# Altium schematic sheet Project_Arduino DUE shield.schdoc
size 437 x 296 mm
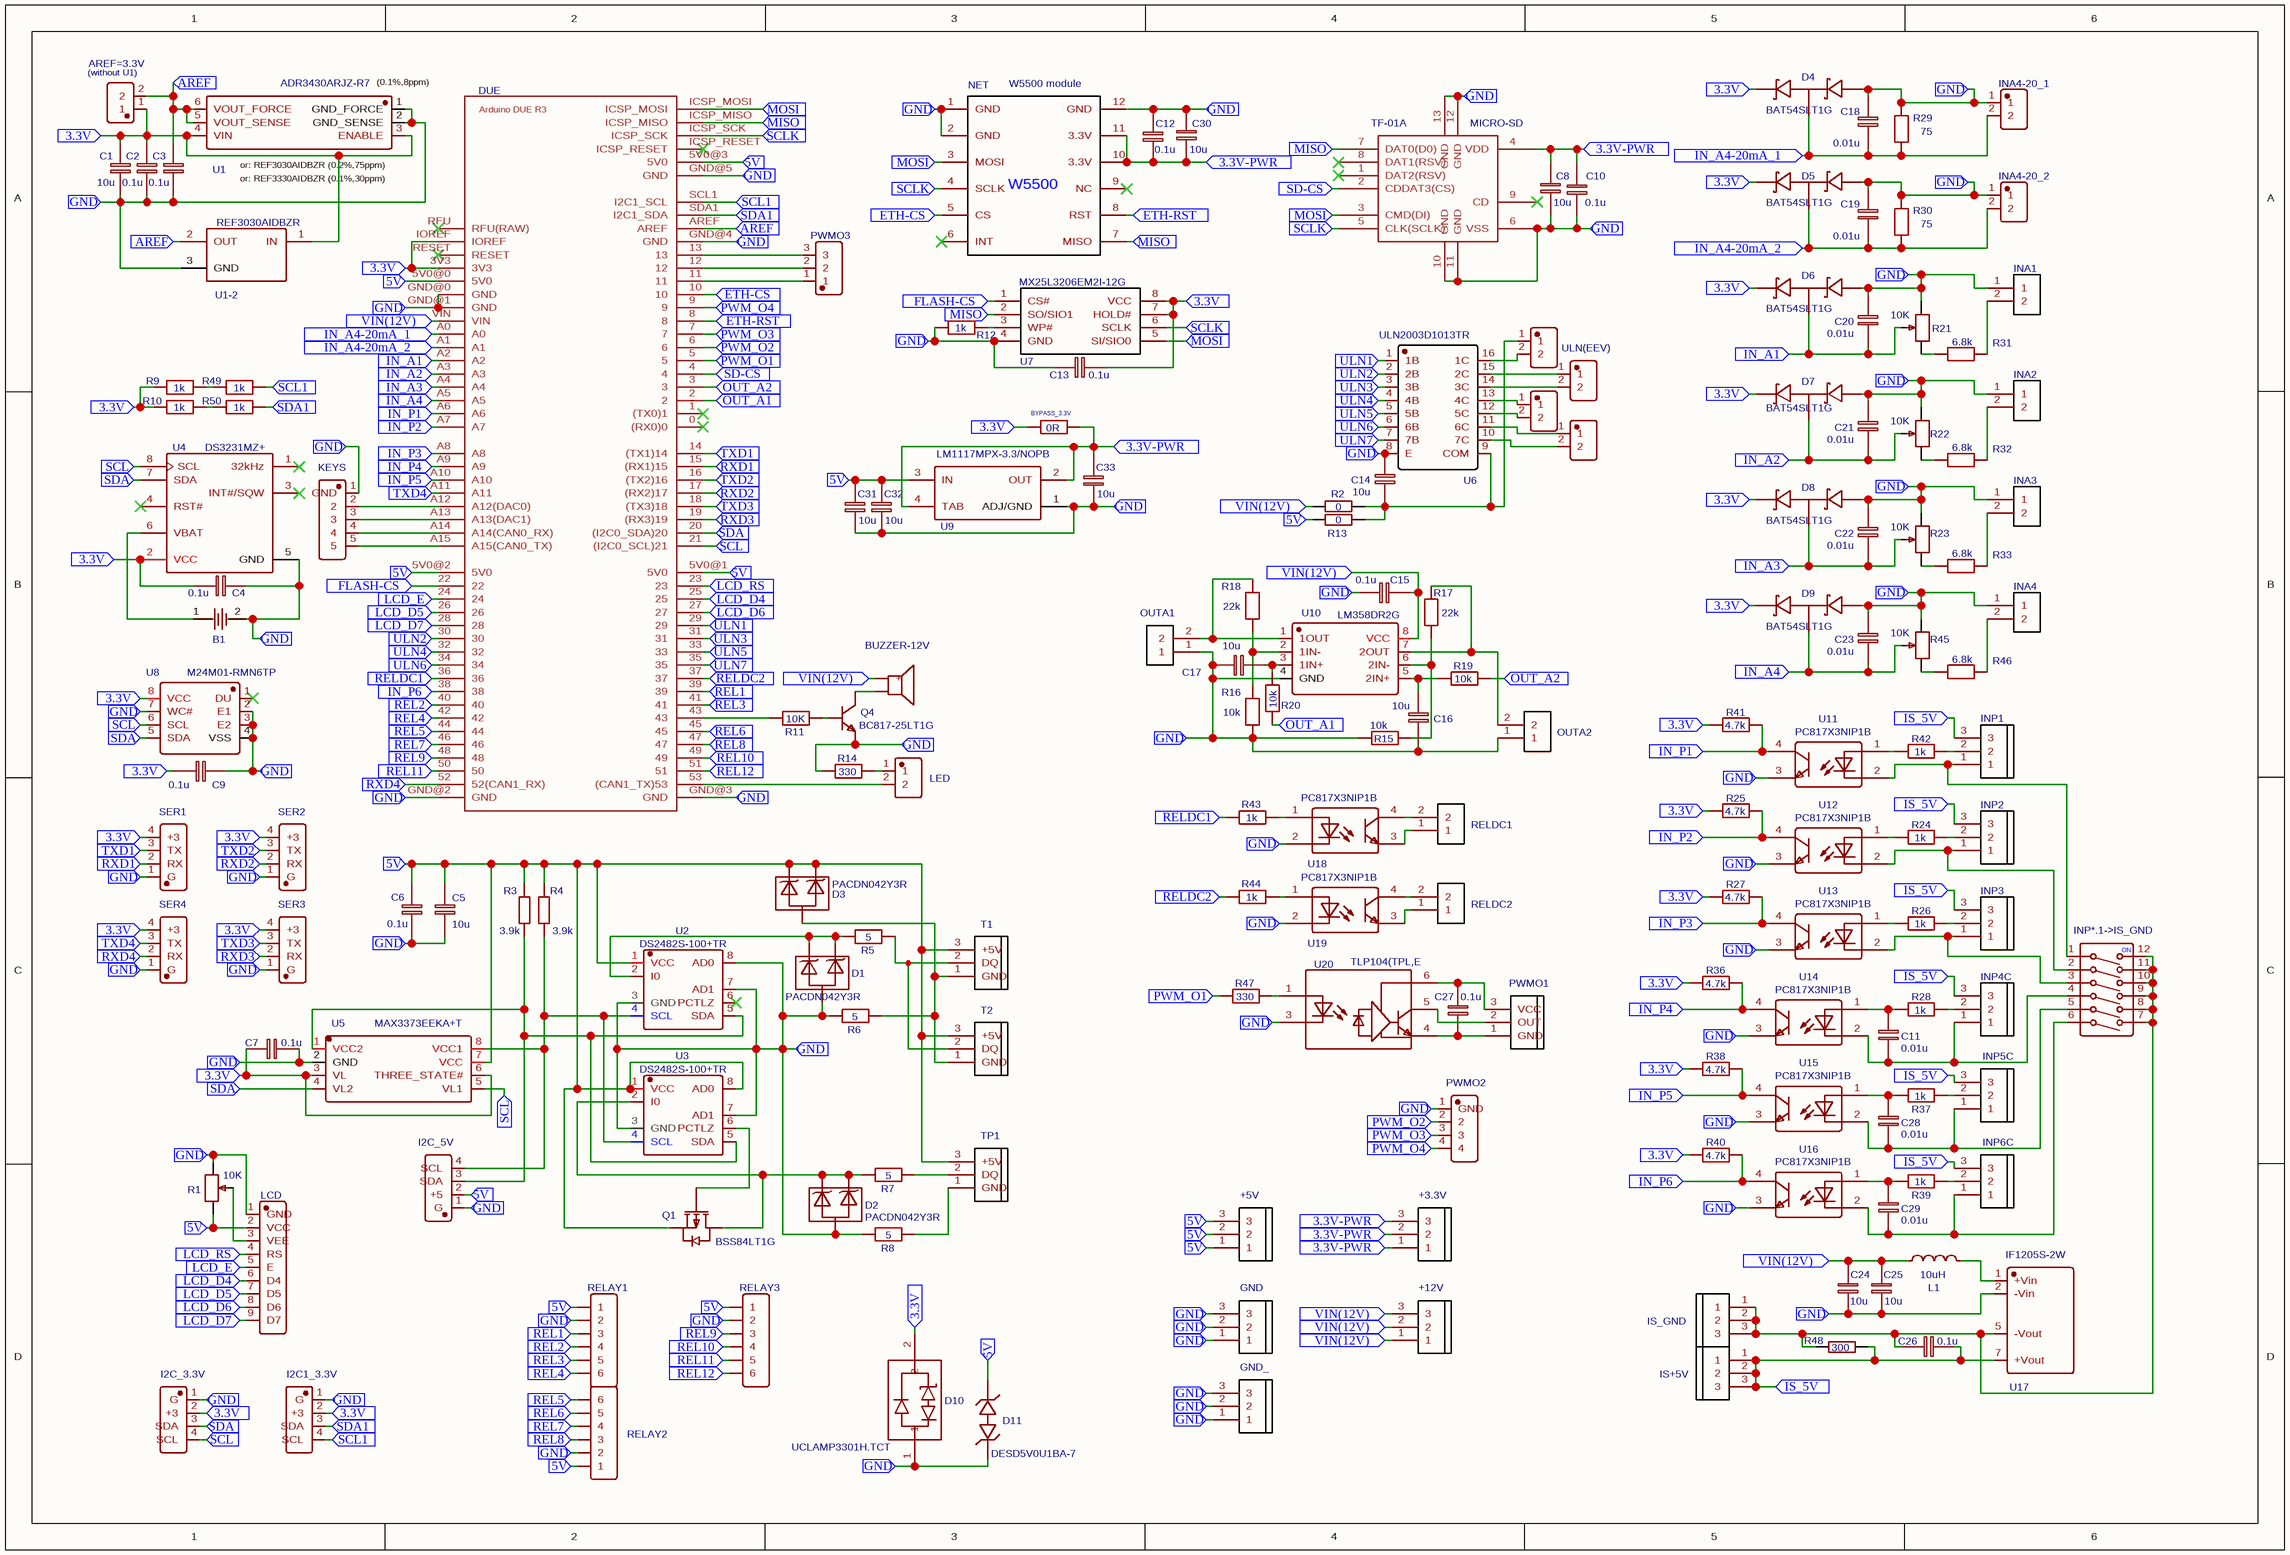
[diagram p0: Project_Arduino DUE shield.schdoc]

## Parts
+3.3V  KF128L-5.08-3P  [CONN-TH_3P-P5.08_KF128L-5.08-3P]  (value not drawn)
+5V  KF128L-5.08-3P  [CONN-TH_3P-P5.08_KF128L-5.08-3P]  (value not drawn)
+12V  KF128L-5.08-3P  [CONN-TH_3P-P5.08_KF128L-5.08-3P]  (value not drawn)
AREF=3.3V  A2541WV-2P  [HDR-TH_P2.54-H-M_A2541WV-2P]  (value not drawn)
B1  CR2032-BS-2-1  [BAT-TH_BS-2-1]  (value not drawn)
BUZZER-12V  TMB12A12  [BUZ-TH_BD12.0-P7.60-D0.6-FD]  (value not drawn)
BYPASS_3.3V  0R  [R0805]
C1  10u  [C_805]
C2  0.1u  [C0603]
C3  0.1u  [C0603]
C4  0.1u  [C0603]
C5  10u  [C_805]
C6  0.1u  [C0603]
C7  0.1u  [C0603]
C8  10u  [C_805]
C9  0.1u  [C0603]
C10  0.1u  [C0603]
C11  0.01u  [C0603]
C12  0.1u  [C0603]
C13  0.1u  [C0603]
C14  10u  [C_805]
C15  0.1u  [C0603]
C16  10u  [C_805]
C17  10u  [C_805]
C18  0.01u  [C0603]
C19  0.01u  [C0603]
C20  0.01u  [C0603]
C21  0.01u  [C0603]
C22  0.01u  [C0603]
C23  0.01u  [C0603]
C24  10u  [C_805]
C25  10u  [C_805]
C26  0.1u  [C0603]
C27  0.1u  [C0603]
C28  0.01u  [C0603]
C29  0.01u  [C0603]
C30  10u  [C_805]
C31  10u  [C_805]
C32  10u  [C_805]
C33  10u  [C_805]
D1  PACDN042Y3R  [SOT-23-3_L3.0-W1.7-P0.95-LS2.9-BR]
D2  PACDN042Y3R  [SOT-23-3_L3.0-W1.7-P0.95-LS2.9-BR]
D3  PACDN042Y3R  [SOT-23-3_L3.0-W1.7-P0.95-LS2.9-BR]
D4  BAT54SLT1G  [SOT-23_L2.9-W1.3-P1.90-LS2.4-BR]
D5  BAT54SLT1G  [SOT-23_L2.9-W1.3-P1.90-LS2.4-BR]
D6  BAT54SLT1G  [SOT-23_L2.9-W1.3-P1.90-LS2.4-BR]
D7  BAT54SLT1G  [SOT-23_L2.9-W1.3-P1.90-LS2.4-BR]
D8  BAT54SLT1G  [SOT-23_L2.9-W1.3-P1.90-LS2.4-BR]
D9  BAT54SLT1G  [SOT-23_L2.9-W1.3-P1.90-LS2.4-BR]
D10  UCLAMP3301H.TCT  [SOD123-SOD523]
D11  DESD5V0U1BA-7  [SOD123-SOD523]
DUE  PA_DUE_BRD  [PA_DUE 1 HOLE]  (value not drawn)
GND  KF128L-5.08-3P  [CONN-TH_3P-P5.08_KF128L-5.08-3P]  (value not drawn)
GND_  KF128L-5.08-3P  [CONN-TH_3P-P5.08_KF128L-5.08-3P]  (value not drawn)
I2C1_3.3V  A2541WV-4P  [HDR-TH_4P-P2.54-V I2C 3.3V]  (value not drawn)
I2C_3.3V  A2541WV-4P  [HDR-TH_4P-P2.54-V I2C 3.3V]  (value not drawn)
I2C_5V  A2541WV-4P  [HDR-TH_4P-P2.54-V I2C 5V]  (value not drawn)
INA1  KF128L-5.08-2P  [CONN-TH_P5.08_KF128L-5.08-2P SIGN]  (value not drawn)
INA2  KF128L-5.08-2P  [CONN-TH_P5.08_KF128L-5.08-2P SIGN]  (value not drawn)
INA3  KF128L-5.08-2P  [CONN-TH_P5.08_KF128L-5.08-2P SIGN]  (value not drawn)
INA4  KF128L-5.08-2P  [CONN-TH_P5.08_KF128L-5.08-2P SIGN]  (value not drawn)
INA4-20_1  KF128L-3.5-2P  [CONN-TH_P3.50_KF128L-3.5-2P SIGN]  (value not drawn)
INA4-20_2  KF128L-3.5-2P  [CONN-TH_P3.50_KF128L-3.5-2P SIGN]  (value not drawn)
INP1  KF128L-5.08-3P  [CONN-TH_3P-P5.08_KF128L-5.08-3P INP]  (value not drawn)
INP2  KF128L-5.08-3P  [CONN-TH_3P-P5.08_KF128L-5.08-3P INP]  (value not drawn)
INP3  KF128L-5.08-3P  [CONN-TH_3P-P5.08_KF128L-5.08-3P INP]  (value not drawn)
INP4C  KF128L-5.08-3P  [CONN-TH_3P-P5.08_KF128L-5.08-3P INP]  (value not drawn)
INP5C  KF128L-5.08-3P  [CONN-TH_3P-P5.08_KF128L-5.08-3P INP]  (value not drawn)
INP6C  KF128L-5.08-3P  [CONN-TH_3P-P5.08_KF128L-5.08-3P INP]  (value not drawn)
INP*.1->IS_GND  EM-06-Q  [SW-SMD_12P-L15.1-W6.0-P2.54-LS9.8]  (value not drawn)
IS+5V  KF128L-5.08-3P  [CONN-TH_3P-P5.08_KF128L-5.08-3P]  (value not drawn)
IS_GND  KF128L-5.08-3P  [CONN-TH_3P-P5.08_KF128L-5.08-3P]  (value not drawn)
KEYS  A2541WV-5P  [HDR-TH_5P-P2.54-V]  (value not drawn)
L1  10uH  [IND-SMD_3.0-4.0W]
LCD  PZ254V-11-09P  [HDR-TH_9P-P2.54-V-M LCD]  (value not drawn)
LED  A2541WV-2P  [HDR-TH_P2.54-H-M_A2541WV-2P]  (value not drawn)
MICRO-SD  TF-01A  [TF-SMD_TF-01A]
NET  W5500 module  [W5500_MODULE]
OUTA1  KF128L-5.08-2P  [CONN-TH_P5.08_KF128L-5.08-2P SIGN]  (value not drawn)
OUTA2  KF128L-5.08-2P  [CONN-TH_P5.08_KF128L-5.08-2P SIGN]  (value not drawn)
PWMO1  KF128L-5.08-3P  [CONN-TH_3P-P5.08_KF128L-5.08-3P]  (value not drawn)
PWMO2  A2541WV-4P  [HDR-TH_4P-P2.54-V]  (value not drawn)
PWMO3  A2541WV-3P  [HDR-TH_3P-P2.54-V-M]  (value not drawn)
Q1  BSS84LT1G  [SOT-23-3_L2.9-W1.6-P1.90-LS2.8-BR]
Q4  BC817-25LT1G  [SOT-23-3_L2.9-W1.6-P1.90-LS2.8-BR]
R1  10K  [RES-ADJ-SMD_3314J]
R2  0  [R1206]
R3  3.9k  [R0603]
R4  3.9k  [R0603]
R5  5  [R0603]
R6  5  [R0603]
R7  5  [R0603]
R8  5  [R0603]
R9  1k  [R0805]
R10  1k  [R0805]
R11  10K  [R0603]
R12  1k  [R0603]
R13  0  [R1206]
R14  330  [R0603]
R15  10k  [R0603]
R16  10k  [R0603]
R17  22k  [R0603]
R18  22k  [R0603]
R19  10k  [R0603]
R20  10k  [R0603]
R21  10K  [RES-ADJ-SMD_3314J]
R22  10K  [RES-ADJ-SMD_3314J]
R23  10K  [RES-ADJ-SMD_3314J]
R24  1k  [R0603]
R25  4.7k  [R0603]
R26  1k  [R0603]
R27  4.7k  [R0603]
R28  1k  [R0603]
R29  75  [R0805]
R30  75  [R0805]
R31  6.8k  [R0603]
R32  6.8k  [R0603]
R33  6.8k  [R0603]
R36  4.7k  [R0603]
R37  1k  [R0603]
R38  4.7k  [R0603]
R39  1k  [R0603]
R40  4.7k  [R0603]
R41  4.7k  [R0603]
R42  1k  [R0603]
R43  1k  [R0603]
R44  1k  [R0603]
R45  10K  [RES-ADJ-SMD_3314J]
R46  6.8k  [R0603]
R47  330  [R0603]
R48  300  [R1206]
R49  1k  [R0805]
R50  1k  [R0805]
RELAY1  Header-Male-2.54_1x6  [HDR-TH_6P-P2.54-V R5V1]  (value not drawn)
RELAY2  Header-Male-2.54_1x6  [HDR-TH_6P-P2.54-V R5V2]  (value not drawn)
RELAY3  Header-Male-2.54_1x6  [HDR-TH_6P-P2.54-V R5V3]  (value not drawn)
RELDC1  KF128L-5.08-2P  [CONN-TH_P5.08_KF128L-5.08-2P SIGN]  (value not drawn)
RELDC2  KF128L-5.08-2P  [CONN-TH_P5.08_KF128L-5.08-2P SIGN]  (value not drawn)
SER1  A2541WV-4P  [HDR-TH_4P-P2.54-V SERIAL]  (value not drawn)
SER2  A2541WV-4P  [HDR-TH_4P-P2.54-V SERIAL]  (value not drawn)
SER3  A2541WV-4P  [HDR-TH_4P-P2.54-V SERIAL]  (value not drawn)
SER4  A2541WV-4P  [HDR-TH_4P-P2.54-V SERIAL]  (value not drawn)
T1  KF128L-5.08-3P  [CONN-TH_3P-P5.08_KF128L-5.08-3P DS18B20]  (value not drawn)
T2  KF128L-5.08-3P  [CONN-TH_3P-P5.08_KF128L-5.08-3P DS18B20]  (value not drawn)
TP1  KF128L-5.08-3P  [CONN-TH_3P-P5.08_KF128L-5.08-3P DS18B20]  (value not drawn)
U1  ADR3430ARJZ-R7  [SOT-23-6_L2.9-W1.6-P0.95-LS2.8-TL]
U1-2  REF3030AIDBZR  [SOT-23-3_L2.9-W1.6-REF]
U2  DS2482S-100+TR  [SOIC-8_L4.9-W3.9-P1.27-LS6.0-BL]
U3  DS2482S-100+TR  [SOIC-8_L4.9-W3.9-P1.27-LS6.0-BL]
U4  DS3231MZ+  [SOIC-8_L4.9-W3.9-P1.27-LS6.0-BL]
U5  MAX3373EEKA+T  [SOT-23-8_L3.0-W1.7-P0.65-LS2.8-TL THIN PADS]
U6  ULN2003D1013TR  [SOIC-16_L9.9-W3.9-P1.27-LS6.0-BL]
U7  MX25L3206EM2I-12G  [SOIC-8_L5.3-W5.3-P1.27-LS8.0-BL]
U8  M24M01-RMN6TP  [SOIC-8_L4.9-W3.9-P1.27-LS6.0-BL]
U9  LM1117MPX-3.3/NOPB  [SOT-223-3_L6.5-W3.4-P2.30-LS7.0-BR]
U10  LM358DR2G  [SOIC-8_L5.0-W4.0-P1.27-LS6.0-BL]
U11  PC817X3NIP1B  [OPTO-SMD-4_L4.6-W6.5-P2.54_SOP-4-L3.9-W4.4]
U12  PC817X3NIP1B  [OPTO-SMD-4_L4.6-W6.5-P2.54_SOP-4-L3.9-W4.4]
U13  PC817X3NIP1B  [OPTO-SMD-4_L4.6-W6.5-P2.54_SOP-4-L3.9-W4.4]
U14  PC817X3NIP1B  [OPTO-SMD-4_L4.6-W6.5-P2.54_SOP-4-L3.9-W4.4]
U15  PC817X3NIP1B  [OPTO-SMD-4_L4.6-W6.5-P2.54_SOP-4-L3.9-W4.4]
U16  PC817X3NIP1B  [OPTO-SMD-4_L4.6-W6.5-P2.54_SOP-4-L3.9-W4.4]
U17  IF1205S-2W  [PWRM-TH_L11.6-19.6]
U18  PC817X3NIP1B  [OPTO-SMD-4_L4.6-W6.5-P2.54_SOP-4-L3.9-W4.4]
U19  PC817X3NIP1B  [OPTO-SMD-4_L4.6-W6.5-P2.54_SOP-4-L3.9-W4.4]
U20  TLP104(TPL,E  [SOP-6_5P-L4.4-W3.6-P1.27-LS7.0-BR-PE2]
ULN(EEV)  KF128L-3.5-2P  [CONN-TH_P3.50_KF128L-3.5-2P]  (value not drawn)
ULN(EEV)1  KF128L-3.5-2P  [CONN-TH_P3.50_KF128L-3.5-2P]  (value not drawn)
ULN(EEV)2  KF128L-3.5-2P  [CONN-TH_P3.50_KF128L-3.5-2P]  (value not drawn)
ULN(EEV)3  KF128L-3.5-2P  [CONN-TH_P3.50_KF128L-3.5-2P]  (value not drawn)

## Ports
3.3V (in), 3.3V-PWR (in), 5V (in), AREF (in), ETH-CS (in), ETH-RST (in), FLASH-CS (in), GND (in), IN_A1 (in), IN_A2 (in), IN_A3 (in), IN_A4 (in), IN_A4-20mA_1 (in), IN_A4-20mA_2 (in), IN_P1 (in), IN_P2 (in), IN_P3 (in), IN_P4 (in), IN_P5 (in), IN_P6 (in), IS_5V (in), LCD_D4 (in), LCD_D5 (in), LCD_D6 (in), LCD_D7 (in), LCD_E (in), LCD_RS (in), MISO (in), MOSI (in), OUT_A1 (in), OUT_A2 (in), PWM_O1 (in), PWM_O2 (in), PWM_O3 (in), PWM_O4 (in), REL1 (in), REL2 (in), REL3 (in), REL4 (in), REL5 (in), REL6 (in), REL7 (in), REL8 (in), REL9 (in), REL10 (in), REL11 (in), REL12 (in), RELDC1 (in), RELDC2 (in), RXD1 (in), RXD2 (in), RXD3 (in), RXD4 (in), SCL1 (in), SCL (in), SCLK (in), SD-CS (in), SDA1 (in), SDA (in), TXD1 (in), TXD2 (in), TXD3 (in), TXD4 (in), ULN1 (in), ULN2 (in), ULN3 (in), ULN4 (in), ULN5 (in), ULN6 (in), ULN7 (in), VIN(12V) (in)

## Nets
3.3V: AREF=3.3V.1 BYPASS_3.3V.1 C1.1 C2.1 C4.2 C7.1 C9.2 C13.2 D4.2(C) D5.2(C) D6.2(C) D7.2(C) D8.2(C) D9.2(C) D10.2 DUE.3V3 DUE.IOREF I2C1_3.3V.2(+3) I2C_3.3V.2(+3) R9.1 R10.1 R25.2 R27.2 R36.2 R38.2 R40.2 R41.2 SER1.4(+3) SER2.4(+3) SER3.4(+3) SER4.4(+3) U1.3(ENABLE) U1.4(VIN) U1-2.1(IN) U4.2(VCC) U5.3(VL) U5.6(THREE_STATE#) U7.7(HOLD#) U7.8(VCC) U8.8(VCC) ; port 3.3V
3.3V-PWR: +3.3V.1 +3.3V.2 +3.3V.3 BYPASS_3.3V.2 C8.1 C10.2 C12.1 C30.2 C33.2 MICRO-SD.4(VDD) NET.10(3.3V) NET.11(3.3V) U9.2(OUT) U9.4(TAB) ; port 3.3V-PWR
5V: +5V.1 +5V.2 +5V.3 C5.1 C6.1 C31.2 C32.2 D3.1 D3.2 D11.2 DUE.5V0@0(5V0) DUE.5V0@1(5V0) DUE.5V0@2(5V0) DUE.5V0@3(5V0) I2C_5V.2(+5) LCD.2(VCC) Q1.2(S) R1.1 R3.2 R4.2 R13.1 RELAY1.1 RELAY2.1 RELAY3.1 T1.3(+5V) T2.3(+5V) TP1.3(+5V) U2.1(VCC) U3.1(VCC) U3.8(AD0) U5.7(VCC) U9.3(IN) ; port 5V
AREF: AREF=3.3V.2 C3.1 DUE.AREF U1.5(VOUT_SENSE) U1.6(VOUT_FORCE) U1-2.2(OUT) ; port AREF
ETH-CS: DUE.10 NET.5(CS) ; port ETH-CS
ETH-RST: DUE.8 NET.8(RST) ; port ETH-RST
FLASH-CS: DUE.22 U7.1(CS#) ; port FLASH-CS
GND: B1.2 C1.2 C2.2 C3.2 C4.1 C5.2 C6.2 C7.2 C8.2 C9.1 C10.1 C12.2 C13.1 C14.1 C15.1 C16.2 C17.1 C18.1 C19.1 C20.1 C21.1 C22.1 C23.1 C24.1 C25.1 C30.1 C31.1 C32.1 C33.1 D1.3 D2.3 D4.1(A) D5.1(A) D6.1(A) D7.1(A) D8.1(A) D9.1(A) D10.1 D11.1 DUE.GND@0(GND) DUE.GND@1(GND) DUE.GND@2(GND) DUE.GND@3(GND) DUE.GND@4(GND) DUE.GND@5(GND) GND.1 GND.2 GND.3 GND_.1 GND_.2 GND_.3 I2C1_3.3V.1(G) I2C_3.3V.1(G) I2C_5V.1(G) INA1.1 INA2.1 INA3.1 INA4.1 INA4-20_1.1 INA4-20_2.1 KEYS.1(GND) LCD.1(GND) MICRO-SD.6(VSS) MICRO-SD.10(GND) MICRO-SD.11(GND) MICRO-SD.12(GND) MICRO-SD.13(GND) NET.1(GND) NET.2(GND) NET.12(GND) OUTA1.1 OUTA2.1 PWMO2.1(GND) Q4.2(E) R1.3 R6.1 R8.1 R12.1 R14.2 R15.1 R16.1 R21.1 R22.1 R23.1 R29.1 R30.1 R45.1 RELAY1.2 RELAY2.2 RELAY3.2 SER1.1(G) SER2.1(G) SER3.1(G) SER4.1(G) U1.1(GND_FORCE) U1.2(GND_SENSE) U1-2.3(GND) U2.3(GND) U2.7(AD1) U2.8(AD0) U3.3(GND) U3.7(AD1) U4.5(GND) U5.2(GND) U6.8(E) U7.4(GND) U8.2(E1) U8.3(E2) U8.4(VSS) U8.7(WC#) U9.1(ADJ/GND) U10.4(GND) U11.3(EM) U12.3(EM) U13.3(EM) U14.3(EM) U15.3(EM) U16.3(EM) U17.2(-Vin) U18.2(CA) U19.2(CA) U20.3 ; port GND
IN_A1: C20.2 D6.3(A/C) DUE.A2 R21.2 ; port IN_A1
IN_A2: C21.2 D7.3(A/C) DUE.A3 R22.2 ; port IN_A2
IN_A3: C22.2 D8.3(A/C) DUE.A4 R23.2 ; port IN_A3
IN_A4: C23.2 D9.3(A/C) DUE.A5 R45.2 ; port IN_A4
IN_A4-20mA_1: C18.2 D4.3(A/C) DUE.A0 INA4-20_1.2 R29.2 ; port IN_A4-20mA_1
IN_A4-20mA_2: C19.2 D5.3(A/C) DUE.A1 INA4-20_2.2 R30.2 ; port IN_A4-20mA_2
IN_P1: DUE.A6 R41.1 U11.4(COL) ; port IN_P1
IN_P2: DUE.A7 R25.1 U12.4(COL) ; port IN_P2
IN_P3: DUE.A8 R27.1 U13.4(COL) ; port IN_P3
IN_P4: DUE.A9 R36.1 U14.4(COL) ; port IN_P4
IN_P5: DUE.A10 R38.1 U15.4(COL) ; port IN_P5
IN_P6: DUE.38 R40.1 U16.4(COL) ; port IN_P6
IS_5V: C26.1 INP1.3 INP2.3 INP3.3 INP4C.3 INP5C.3 INP6C.3 IS+5V.1 IS+5V.2 IS+5V.3 R48.2 U17.7(+Vout) ; port IS_5V
LCD_D4: DUE.25 LCD.6(D4) ; port LCD_D4
LCD_D5: DUE.26 LCD.7(D5) ; port LCD_D5
LCD_D6: DUE.27 LCD.8(D6) ; port LCD_D6
LCD_D7: DUE.28 LCD.9(D7) ; port LCD_D7
LCD_E: DUE.24 LCD.5(E) ; port LCD_E
LCD_RS: DUE.23 LCD.4(RS) ; port LCD_RS
MISO: DUE.ICSP_MISO MICRO-SD.7(DAT0(D0)) NET.7(MISO) U7.2(SO/SIO1) ; port MISO
MOSI: DUE.ICSP_MOSI MICRO-SD.3(CMD(DI)) NET.3(MOSI) U7.5(SI/SIO0) ; port MOSI
OUT_A1: DUE.2 R20.1 ; port OUT_A1
OUT_A2: DUE.3 R19.2 ; port OUT_A2
PWM_O1: DUE.5 R47.1 ; port PWM_O1
PWM_O2: DUE.6 PWMO2.2 ; port PWM_O2
PWM_O3: DUE.7 PWMO2.3 ; port PWM_O3
PWM_O4: DUE.9 PWMO2.4 ; port PWM_O4
REL1: DUE.39 RELAY1.3 ; port REL1
REL2: DUE.40 RELAY1.4 ; port REL2
REL3: DUE.41 RELAY1.5 ; port REL3
REL4: DUE.42 RELAY1.6 ; port REL4
REL5: DUE.44 RELAY2.6 ; port REL5
REL6: DUE.45 RELAY2.5 ; port REL6
REL7: DUE.46 RELAY2.4 ; port REL7
REL8: DUE.47 RELAY2.3 ; port REL8
REL9: DUE.48 RELAY3.3 ; port REL9
REL10: DUE.49 RELAY3.4 ; port REL10
REL11: DUE.50 RELAY3.5 ; port REL11
REL12: DUE.51 RELAY3.6 ; port REL12
RELDC1: DUE.36 R43.1 ; port RELDC1
RELDC2: DUE.37 R44.1 ; port RELDC2
RXD1: DUE.15((RX1)15) SER1.2(RX) ; port RXD1
RXD2: DUE.17((RX2)17) SER2.2(RX) ; port RXD2
RXD3: DUE.19((RX3)19) SER3.2(RX) ; port RXD3
RXD4: DUE.52(52(CAN1_RX)) SER4.2(RX) ; port RXD4
SCL: DUE.21((I2C0_SCL)21) I2C_3.3V.4(SCL) U4.8(SCL) U5.5(VL1) U8.6(SCL) ; port SCL
SCL1: DUE.SCL1(I2C1_SCL) I2C1_3.3V.4(SCL) R49.2 ; port SCL1
SCLK: DUE.ICSP_SCK MICRO-SD.5(CLK(SCLK)) NET.4(SCLK) U7.6(SCLK) ; port SCLK
SD-CS: DUE.4 MICRO-SD.2(CDDAT3(CS)) ; port SD-CS
SDA: DUE.20((I2C0_SDA)20) I2C_3.3V.3(SDA) U4.7(SDA) U5.4(VL2) U8.5(SDA) ; port SDA
SDA1: DUE.SDA1(I2C1_SDA) I2C1_3.3V.3(SDA) R50.2 ; port SDA1
TXD1: DUE.14((TX1)14) SER1.3(TX) ; port TXD1
TXD2: DUE.16((TX2)16) SER2.3(TX) ; port TXD2
TXD3: DUE.18((TX3)18) SER3.3(TX) ; port TXD3
TXD4: DUE.A11 SER4.3(TX) ; port TXD4
ULN1: DUE.29 U6.1(1B) ; port ULN1
ULN2: DUE.30 U6.2(2B) ; port ULN2
ULN3: DUE.31 U6.3(3B) ; port ULN3
ULN4: DUE.32 U6.4(4B) ; port ULN4
ULN5: DUE.33 U6.5(5B) ; port ULN5
ULN6: DUE.34 U6.6(6B) ; port ULN6
ULN7: DUE.35 U6.7(7B) ; port ULN7
VIN(12V): +12V.1 +12V.2 +12V.3 BUZZER-12V.1(+) C15.2 C24.2 C25.2 DUE.VIN L1.1 R2.1 U10.8(VCC) ; port VIN(12V)
NetB1_1: B1.1 U4.6(VBAT)
NetBUZZER-12V_2: BUZZER-12V.2 Q4.3(C)
NetC11_1: C11.1 R28.2 U14.1(AN)
NetC11_2: C11.2 INP4C.1 INP*.1->IS_GND.4 U14.2(CA)
NetC14_2: C14.2 R2.2 R13.2 U6.9(COM) ULN(EEV).1
NetC16_1: C16.1 R19.1 U10.5(2IN+)
NetC17_2: C17.2 R20.2 U10.3(1IN+)
NetC26_2: C26.2 INP*.1->IS_GND.7 INP*.1->IS_GND.8 INP*.1->IS_GND.9 INP*.1->IS_GND.10 INP*.1->IS_GND.11 INP*.1->IS_GND.12 IS_GND.1 IS_GND.2 IS_GND.3 R48.1 U17.5(-Vout)
NetC27_1: C27.1 PWMO1.1(GND) U20.4
NetC27_2: C27.2 PWMO1.3(VCC) U20.6
NetC28_1: C28.1 R37.2 U15.1(AN)
NetC28_2: C28.2 INP5C.1 INP*.1->IS_GND.5 U15.2(CA)
NetC29_1: C29.1 R39.2 U16.1(AN)
NetC29_2: C29.2 INP6C.1 INP*.1->IS_GND.6 U16.2(CA)
NetD1_1: D1.1 D1.2 R5.1 U2.2(I0)
NetD2_1: D2.1 D2.2 Q1.3(D) R7.1 U3.2(I0)
NetD3_3: D3.3 R6.2 T1.1(GND) T2.1(GND)
NetDUE_11: DUE.11 PWMO3.1
NetDUE_12: DUE.12 PWMO3.2
NetDUE_13: DUE.13 PWMO3.3
NetDUE_43: DUE.43 R11.2
NetDUE_53: DUE.53((CAN1_TX)53) LED.2
NetDUE_A12: DUE.A12(A12(DAC0)) KEYS.2
NetDUE_A13: DUE.A13(A13(DAC1)) KEYS.3
NetDUE_A14: DUE.A14(A14(CAN0_RX)) KEYS.4
NetDUE_A15: DUE.A15(A15(CAN0_TX)) KEYS.5
NetI2C_5V_3: I2C_5V.3(SDA) R3.1 U2.5(SDA) U3.5(SDA) U5.1(VCC2)
NetI2C_5V_4: I2C_5V.4(SCL) R4.1 U2.4(SCL) U3.4(SCL) U5.8(VCC1)
NetINA1_2: INA1.2 R31.1
NetINA2_2: INA2.2 R32.1
NetINA3_2: INA3.2 R33.1
NetINA4_2: INA4.2 R46.1
NetINP1_1: INP1.1 INP*.1->IS_GND.1 U11.2(CA)
NetINP1_2: INP1.2 R42.1
NetINP2_1: INP2.1 INP*.1->IS_GND.2 U12.2(CA)
NetINP2_2: INP2.2 R24.1
NetINP3_1: INP3.1 INP*.1->IS_GND.3 U13.2(CA)
NetINP3_2: INP3.2 R26.1
NetINP4C_2: INP4C.2 R28.1
NetINP5C_2: INP5C.2 R37.1
NetINP6C_2: INP6C.2 R39.1
NetL1_2: L1.2 U17.1(+Vin)
NetLCD_3: LCD.3(VEE) R1.2
NetLED_1: LED.1 R14.1
NetOUTA1_2: OUTA1.2 R18.2 U10.1(1OUT)
NetOUTA2_2: OUTA2.2 R17.2 U10.7(2OUT)
NetPWMO1_2: PWMO1.2(OUT) U20.5
NetQ1_1: Q1.1(G) U3.6(PCTLZ)
NetQ4_1: Q4.1(B) R11.1
NetR5_2: R5.2 T1.2(DQ) T2.2(DQ)
NetR7_2: R7.2 TP1.2(DQ)
NetR8_2: R8.2 TP1.1(GND)
NetR9_2: R9.2 R49.1
NetR10_2: R10.2 R50.1
NetR12_2: R12.2 U7.3(WP#)
NetR15_2: R15.2 R17.1 U10.6(2IN-)
NetR16_2: R16.2 R18.1 U10.2(1IN-)
NetR21_3: R21.3 R31.2
NetR22_3: R22.3 R32.2
NetR23_3: R23.3 R33.2
NetR24_2: R24.2 U12.1(AN)
NetR26_2: R26.2 U13.1(AN)
NetR42_2: R42.2 U11.1(AN)
NetR43_2: R43.2 U18.1(AN)
NetR44_2: R44.2 U19.1(AN)
NetR45_3: R45.3 R46.2
NetR47_2: R47.2 U20.1
NetRELDC1_1: RELDC1.1 U18.3(EM)
NetRELDC1_2: RELDC1.2 U18.4(COL)
NetRELDC2_1: RELDC2.1 U19.3(EM)
NetRELDC2_2: RELDC2.2 U19.4(COL)
NetU6_10: U6.10(7C) ULN(EEV)3.2
NetU6_11: U6.11(6C) ULN(EEV)3.1
NetU6_12: U6.12(5C) ULN(EEV)2.2
NetU6_13: U6.13(4C) ULN(EEV)2.1
NetU6_14: U6.14(3C) ULN(EEV)1.2
NetU6_15: U6.15(2C) ULN(EEV)1.1
NetU6_16: U6.16(1C) ULN(EEV).2

Not connected (* = marked no-connect by the designer): DUE 0((RX0)0)* 1((TX0)1)* ICSP_RESET* RESET* RFU(RFU(RAW))*; MICRO-SD 1(DAT2(RSV))* 8(DAT1(RSV))* 9(CD)*; NET 6(INT)* 9(NC)*; U2 6(PCTLZ)*; U4 1(32kHz)* 3(INT#/SQW)* 4(RST#)*; U8 1(DU)*

## Notes on the sheet
- (near AREF=3.3V) (without U1)
- (near U1) (0.1%,8ppm)
- (near U1) or: REF3030AIDBZR (0.2%,75ppm)
- or: REF3330AIDBZR (0.1%,30ppm)
- (in symbol EM-06-Q) ON
- (in symbol PA_DUE_BRD) Arduino DUE R3
- (in symbol W5500 module) W5500

## Library data of the parts
+3.3V +5V +12V GND GND_ INP1-INP3 INP4C INP5C INP6C IS+5V IS_GND PWMO1 T1 T2 TP1 = KF128L-5.08-3P: BOM_Manufacturer: Cixi Kefa Elec; SMT Type: Extend; BOM_Supplier: LCSC; BOM_Manufacturer Part: KF128L-5.08-3P; image: //image.lceda.cn/szlcsc/C72334.jpg; BOM_Supplier Part: C474941; BOM_LCSC Assembly: Yes; spicePre: P; spiceSymbolName: WJ500V-5.08-3P-14-00A
AREF=3.3V LED = A2541WV-2P: BOM_Manufacturer: CJT(Changjiang Connectors); Contributor: LCSC; SMT Type: Extend; BOM_Supplier: LCSC; BOM_Supplier Part: C225477; BOM_Manufacturer Part: A2541WV-2P; BOM_LCSC Assembly: Yes; spicePre: H; spiceSymbolName: A2541WV-2P
B1 = CR2032-BS-2-1: BOM_Manufacturer: Q&J; BOM_Manufacturer Part: BS-2-1; BOM_Supplier: LCSC; image: //image.lceda.cn/szlcsc/C70376.jpg; BOM_Supplier Part: C70376; spicePre: B; spiceSymbolName: CR2032-BS-2-1
BUZZER-12V = TMB12A12: BOM_Manufacturer: HNDZ; SMT Type: Extend; BOM_Supplier: LCSC; BOM_Manufacturer Part: TMB12A12; BOM_Supplier Part: C96079; BOM_LCSC Assembly: Yes; spicePre: B; spiceSymbolName: TMB12A12
BYPASS_3.3V = 0R: nameAlias: Value(Ω); Contributor: LCEDA_Lib; spicePre: R; spiceSymbolName: R_0805_EU
C1 C14 C16 C17 C31-C33 = 10u: BOM_Manufacturer Part: CL21A106KAYNNNE; BOM_Manufacturer: SAMSUNG; nameAlias: Value(F); spicePre: C; BOM_Supplier: LCSC; BOM_Supplier Part: C15850
  C1: spiceSymbolName: Cap_RAD-0.1_EU
  C14: spiceSymbolName: Cap_1206_EU
  C16 C17 C31-C33: spiceSymbolName: Cap_0603_EU
C2-C4 C9 C15 C26 C27 = 0.1u: BOM_Manufacturer Part: CC0603KRX7R9BB104; BOM_Manufacturer: YAGEO; nameAlias: Value(F); spicePre: C; BOM_Supplier: LCSC; BOM_Supplier Part: C14663
  C2-C4 C9: spiceSymbolName: Cap_RAD-0.1_EU
  C15 C26 C27: spiceSymbolName: Cap_0805_EU
C5 = 10u: BOM_Manufacturer Part: CL21A106KAYNNNE; BOM_Manufacturer: SAMSUNG; nameAlias: Value(F); BOM_Mounted: Yes; spicePre: C; spiceSymbolName: Capacitor; BOM_Supplier: LCSC; BOM_Supplier Part: C15850
C6 C7 = 0.1u: BOM_Manufacturer Part: CC0603KRX7R9BB104; BOM_Manufacturer: YAGEO; nameAlias: Value(F); BOM_Mounted: Yes; spicePre: C; spiceSymbolName: Capacitor; BOM_Supplier: LCSC; BOM_Supplier Part: C14663
C8 C24 C25 C30 = 10u: BOM_Manufacturer Part: CL21A106KAYNNNE; BOM_Manufacturer: SAMSUNG; nameAlias: Value(F); Contributor: LCEDA_Lib; BOM_Supplier Part: C15850; BOM_Supplier: LCSC; spicePre: C; spiceSymbolName: C_0603_EU
C10 C12 C13 = 0.1u: BOM_Manufacturer Part: CC0603KRX7R9BB104; BOM_Manufacturer: YAGEO; nameAlias: Value(F); Contributor: LCEDA_Lib; BOM_Supplier Part: C14663; BOM_Supplier: LCSC; spicePre: C; spiceSymbolName: C_0603_EU
C11 C28 C29 = 0.01u: BOM_Manufacturer Part: 0603B103K500NT; BOM_Manufacturer: FH; nameAlias: Value(F); Contributor: LCEDA_Lib; BOM_Supplier Part: C57112; BOM_Supplier: LCSC; spicePre: C; spiceSymbolName: C_0603_EU
C18-C23 = 0.01u: BOM_Manufacturer Part: 0603B103K500NT; BOM_Manufacturer: FH; nameAlias: Value(F); spicePre: C; spiceSymbolName: Cap_0805_EU; BOM_Supplier: LCSC; BOM_Supplier Part: C57112
D1-D3 = PACDN042Y3R: BOM_Manufacturer: ON Semicon; Contributor: LCSC; SMT Type: Extend; BOM_Supplier: LCSC; BOM_Supplier Part: C233486; BOM_Manufacturer Part: PACDN042Y3R; BOM_LCSC Assembly: Yes; spicePre: D; spiceSymbolName: PACDN042Y3R
D4-D9 = BAT54SLT1G: BOM_Manufacturer: ON; SMT Type: Extend; BOM_Supplier: LCSC; BOM_Manufacturer Part: BAT54SLT1G; image: //image.lceda.cn/szlcsc/C19726.jpg; BOM_Supplier Part: C19726; BOM_JLCPCB SMD: Yes; spicePre: D; spiceSymbolName: BAT54SLT1G
D10 = UCLAMP3301H.TCT: BOM_Manufacturer: SEMTECH; Contributor: LCSC; SMT Type: Extend; BOM_Assembly Type: smtWeld; BOM_Paste Type: expand; BOM_Supplier Part: C117558; BOM_Supplier: LCSC; BOM_Manufacturer Part: UCLAMP3301H.TCT; BOM_JLCPCB SMD: Yes; BOM_LCSC Assembly: Yes; spicePre: D; spiceSymbolName: UCLAMP3301H.TCT
D11 = DESD5V0U1BA-7: BOM_Manufacturer: Diodes Incorporated; Contributor: LCSC; BOM_Supplier: LCSC; BOM_Supplier Part: C460442; BOM_Manufacturer Part: DESD5V0U1BA-7; spicePre: D; spiceSymbolName: DESD5V0U1BA-7
DUE = PA_DUE_BRD: description: PatternAgents Due Shield Board Pattern; Contributor: PatternAgents; BOM_Manufacturer Part: ?; spicePre: G
I2C1_3.3V = A2541WV-4P: BOM_Manufacturer: Changjiang Connectors; Contributor: LCSC; SMT Type: Extend; Package Display: No; BOM_Supplier: LCSC; BOM_Supplier Part: C225479; BOM_Manufacturer Part: A2541WV-4P; BOM_LCSC Assembly: Yes; spicePre: H; spiceSymbolName: A2541WV-4P
I2C_3.3V I2C_5V PWMO2 SER1-SER4 = A2541WV-4P: BOM_Manufacturer: Changjiang Connectors; Contributor: LCSC; SMT Type: Extend; BOM_Supplier: LCSC; BOM_Supplier Part: C225479; BOM_Manufacturer Part: A2541WV-4P; BOM_LCSC Assembly: Yes; spicePre: H; spiceSymbolName: A2541WV-4P
INA1-INA4 RELDC1 RELDC2 = KF128L-5.08-2P: BOM_Manufacturer: Cixi Kefa Elec; SMT Type: Extend; BOM_Supplier: LCSC; BOM_Manufacturer Part: KF128L-5.08-2P; image: //image.lceda.cn/szlcsc/C8465.jpg; BOM_Supplier Part: C474940; BOM_LCSC Assembly: Yes; spicePre: P; spiceSymbolName: WJ500V-5.08-2P-14-00A
INA4-20_1 INA4-20_2 ULN(EEV) ULN(EEV)1-ULN(EEV)3 = KF128L-3.5-2P: BOM_Manufacturer: Cixi Kefa Elec; Contributor: LCSC; SMT Type: Extend; BOM_Assembly Type: manualWeld; BOM_Paste Type: expand; BOM_Supplier: LCSC; BOM_Supplier Part: C474930; BOM_Manufacturer Part: KF128L-3.5-2P; BOM_LCSC Assembly: Yes; spicePre: U; spiceSymbolName: KF128L-3.5-2P
INP*.1->IS_GND = EM-06-Q: BOM_Manufacturer: Diptronics; Contributor: LCSC; SMT Type: Extend; BOM_Assembly Type: smtWeld; BOM_Paste Type: expand; BOM_Supplier: LCSC; BOM_Supplier Part: C501580; BOM_Manufacturer Part: EM-06-Q; BOM_LCSC Assembly: Yes; spicePre: S; spiceSymbolName: EM-06-Q
KEYS = A2541WV-5P: BOM_Manufacturer: Changjiang Connectors; Contributor: LCSC; SMT Type: Extend; BOM_Supplier: LCSC; BOM_Supplier Part: C225480; BOM_Manufacturer Part: A2541WV-5P; BOM_LCSC Assembly: Yes; spicePre: H; spiceSymbolName: A2541WV-5P
L1 = 10uH: BOM_Manufacturer: cjiang; BOM_Manufacturer Part: FNR4018S100MT; nameAlias: Inductance; Contributor: LCSC; BOM_Supplier: LCSC; BOM_Supplier Part: C167808; spicePre: L; spiceSymbolName: FNR4018S100MT
LCD = PZ254V-11-09P: BOM_Manufacturer: XFCN; Contributor: LCSC; SMT Type: Extend; BOM_Supplier: LCSC; BOM_Supplier Part: C492408; BOM_Manufacturer Part: PZ254V-11-09P; BOM_LCSC Assembly: Yes; spicePre: H; spiceSymbolName: PZ254V-11-09P
MICRO-SD = TF-01A: BOM_Manufacturer: SOFNG; BOM_Manufacturer Part: TF-15×15; BOM_Supplier: LCSC; BOM_Supplier Part: C111196; spicePre: C; spiceSymbolName: TF-01A
NET = W5500 module: Contributor: RubenDijk; BOM_Manufacturer Part: ?; spicePre: U
OUTA1 OUTA2 = KF128L-5.08-2P: BOM_Manufacturer: Cixi Kefa Elec; BOM_Manufacturer Part: KF128L-3.5-2P; SMT Type: Extend; BOM_Supplier: LCSC; image: //image.lceda.cn/szlcsc/C8465.jpg; BOM_Supplier Part: C474930; BOM_LCSC Assembly: Yes; spicePre: P; spiceSymbolName: WJ500V-5.08-2P-14-00A
PWMO3 = A2541WV-3P: BOM_Manufacturer: Changjiang Connectors; Contributor: LCSC; SMT Type: Extend; BOM_Supplier: LCSC; BOM_Supplier Part: C225478; BOM_Manufacturer Part: A2541WV-3P; BOM_LCSC Assembly: Yes; spicePre: H; spiceSymbolName: A2541WV-3P
Q1 = BSS84LT1G: BOM_Manufacturer: LRC; BOM_Manufacturer Part: LBSS84LT1G; SMT Type: Extend; BOM_Supplier: LCSC; image: //image.lceda.cn/szlcsc/C82079.jpg; BOM_Supplier Part: C8492; BOM_JLCPCB SMD: Yes; BOM_LCSC Assembly: Yes; spicePre: Q; spiceSymbolName: BSS84LT1G
Q4 = BC817-25LT1G: BOM_Manufacturer: ON; SMT Type: Extend; BOM_Supplier: LCSC; BOM_Manufacturer Part: BC817-25LT1G; image: //image.lceda.cn/szlcsc/C82635.jpg; BOM_Supplier Part: C82635; BOM_JLCPCB SMD: Yes; BOM_LCSC Assembly: Yes; spicePre: Q; spiceSymbolName: BC817-25LT1G
R1 R21-R23 R45 = 10K: BOM_Manufacturer: BOURNS; BOM_Manufacturer Part: 3314J-1-103E; nameAlias: Resistance (Ohms); SMT Type: Extend; BOM_Supplier: LCSC; BOM_Supplier Part: C36376; Resistance(Ohms): 10K; BOM_LCSC Assembly: Yes; spicePre: R; spiceSymbolName: 3314J-1-103E
R2 R13 = 0: nameAlias: Resistance (Ohms); spicePre: R; spiceSymbolName: 0805W8F0000T5E
R3 R4 = 3.9k: BOM_Manufacturer Part: 0603WAF3901T5E; BOM_Manufacturer: UniOhm; nameAlias: Value(Ω); BOM_Mounted: Yes; spicePre: R; spiceSymbolName: Resistor; BOM_Supplier: LCSC; BOM_Supplier Part: C23018
R5-R8 = 5: BOM_Manufacturer Part: 0603WAF510KT5E; BOM_Manufacturer: UniOhm; nameAlias: Value(Ω); Contributor: LCEDA_Lib; BOM_Supplier Part: C25197; BOM_Supplier: LCSC; spicePre: R; spiceSymbolName: R_0603_EU
R9 R10 R12 R43 R44 R49 R50 = 1k: BOM_Manufacturer Part: 0603WAF1001T5E; BOM_Manufacturer: UniOhm; nameAlias: Value(Ω); Contributor: LCEDA_Lib; BOM_Supplier Part: C21190; BOM_Supplier: LCSC; spicePre: R
  R9 R10 R49 R50: spiceSymbolName: R_0805_EU
  R12 R43 R44: spiceSymbolName: R_0603_EU
R11 = 10K: BOM_Manufacturer Part: 0603WAF1002T5E; BOM_Manufacturer: UniOhm; nameAlias: Value(Ω); spicePre: R; spiceSymbolName: Res_0805(1/8W)_EU; BOM_Supplier: LCSC; BOM_Supplier Part: C25804
R14 R47 = 330: BOM_Manufacturer Part: 0603WAF3300T5E; BOM_Manufacturer: UniOhm; nameAlias: Value(Ω); Contributor: LCEDA_Lib; BOM_Supplier Part: C23138; BOM_Supplier: LCSC; spicePre: R
  R14: spiceSymbolName: R_0805_EU
  R47: spiceSymbolName: R_0603_EU
R15 R16 R19 R20 = 10k: BOM_Manufacturer Part: 0603WAF1002T5E; BOM_Manufacturer: UniOhm; nameAlias: Value(Ω); spicePre: R; spiceSymbolName: Res_0805(1/8W)_EU; BOM_Supplier: LCSC; BOM_Supplier Part: C25804
R17 R18 = 22k: BOM_Manufacturer Part: 0603WAF2202T5E; BOM_Manufacturer: UniOhm; nameAlias: Value(Ω); spicePre: R; spiceSymbolName: Res_0805(1/8W)_EU; BOM_Supplier: LCSC; BOM_Supplier Part: C31850
R24 R26 R28 R37 R39 R42 = 1k: BOM_Manufacturer Part: 0603WAF1001T5E; BOM_Manufacturer: UniOhm; nameAlias: Value(Ω); spicePre: R; spiceSymbolName: Res_0805(1/8W)_EU; BOM_Supplier: LCSC; BOM_Supplier Part: C21190
R25 R27 R36 R38 R40 R41 = 4.7k: BOM_Manufacturer Part: 0603WAF4701T5E; BOM_Manufacturer: UniOhm; nameAlias: Value(Ω); spicePre: R; spiceSymbolName: Res_0805(1/8W)_EU; BOM_Supplier: LCSC; BOM_Supplier Part: C23162
R29 R30 = 75: BOM_Manufacturer Part: 0805W8F750JT5E; BOM_Manufacturer: UniOhm; nameAlias: Value(Ω); spicePre: R; spiceSymbolName: Res_0805(1/8W)_EU; BOM_Supplier: LCSC; BOM_Supplier Part: C20638
R31-R33 R46 = 6.8k: BOM_Manufacturer Part: 0603WAF6801T5E; BOM_Manufacturer: UniOhm; nameAlias: Value(Ω); spicePre: R; spiceSymbolName: Res_0805(1/8W)_EU; BOM_Supplier: LCSC; BOM_Supplier Part: C23212
R48 = 300: BOM_Manufacturer: UniOhm; BOM_Manufacturer Part: 1206W4F3000T5E; nameAlias: Resistance (Ohms); SMT Type: Basic; BOM_Supplier: LCSC; BOM_Supplier Part: C17887; BOM_JLCPCB SMD: Yes; BOM_LCSC Assembly: Yes; spicePre: R; spiceSymbolName: 1206W4F3000T5E
RELAY1-RELAY3 = Header-Male-2.54_1x6: BOM_Manufacturer: BOOMELE; SMT Type: Extend; BOM_Supplier: LCSC; BOM_Manufacturer Part: Header-Male-2.54_1x6; BOM_Supplier Part: C37208; BOM_LCSC Assembly: Yes; spicePre: H; spiceSymbolName: Header-Male-2.54_1x6
U1 = ADR3430ARJZ-R7: BOM_Manufacturer: ADI; Contributor: LCSC; SMT Type: Extend; BOM_Supplier: LCSC; BOM_Manufacturer Part: ADR3430ARJZ-R7; BOM_Supplier Part: C138535; BOM_JLCPCB SMD: Yes; BOM_LCSC Assembly: Yes; spicePre: U; spiceSymbolName: ADR3430ARJZ-R7
U1-2 = REF3030AIDBZR: BOM_Manufacturer: TI; SMT Type: Extend; BOM_Assembly Type: smtWeld; BOM_Paste Type: recommend; BOM_Supplier: LCSC; BOM_Manufacturer Part: REF3030AIDBZR; image: //image.lceda.cn/szlcsc/C38423.jpg; BOM_Supplier Part: C38423; BOM_JLCPCB SMD: Yes; spicePre: U; spiceSymbolName: REF3030AIDBZR
U2 U3 = DS2482S-100+TR: BOM_Manufacturer: MAXIM; BOM_Manufacturer Part: DS2482S-100+T&R; Contributor: LCSC; SMT Type: Extend; BOM_Supplier: LCSC; BOM_Supplier Part: C143306; BOM_JLCPCB SMD: Yes; BOM_LCSC Assembly: Yes; spicePre: U; spiceSymbolName: DS2482S-100+T&amp;amp;R
U4 = DS3231MZ+: BOM_Manufacturer: MAXIM; SMT Type: Extend; BOM_Supplier: LCSC; BOM_Manufacturer Part: DS3231MZ+; BOM_Supplier Part: C107410; BOM_JLCPCB SMD: Yes; spicePre: U; spiceSymbolName: DS3231MZ+
U5 = MAX3373EEKA+T: BOM_Manufacturer: Maxim Integrated; Contributor: LCSC; SMT Type: Extend; BOM_Supplier: LCSC; BOM_Supplier Part: C116658; BOM_Manufacturer Part: MAX3373EEKA+T; BOM_JLCPCB SMD: Yes; BOM_LCSC Assembly: Yes; spicePre: U; spiceSymbolName: MAX3373EEKA+T
U6 = ULN2003D1013TR: BOM_Manufacturer: TI; BOM_Manufacturer Part: ULN2003ADR; SMT Type: Extend; BOM_Supplier: LCSC; image: //image.lceda.cn/szlcsc/C61273.jpg; BOM_Supplier Part: C7512; BOM_JLCPCB SMD: Yes; BOM_LCSC Assembly: Yes; spicePre: U; spiceSymbolName: ULN2003D1013TR
U7 = MX25L3206EM2I-12G: BOM_Manufacturer: Micronix; SMT Type: Extend; BOM_Supplier: LCSC; BOM_Manufacturer Part: MX25L3206EM2I-12G; image: //image.lceda.cn/szlcsc/C16142.jpg; BOM_Supplier Part: C16142; BOM_JLCPCB SMD: Yes; BOM_LCSC Assembly: Yes; spicePre: U; spiceSymbolName: MX25L3206EM2I-12G
U8 = M24M01-RMN6TP: BOM_Manufacturer: STMicroelectronics; SMT Type: Extend; BOM_Supplier: LCSC; BOM_Manufacturer Part: M24M01-RMN6TP; image: //image.lceda.cn/szlcsc/C79990.jpg; BOM_Supplier Part: C79990; BOM_JLCPCB SMD: Yes; BOM_LCSC Assembly: Yes; spicePre: U; spiceSymbolName: M24M01-RMN6TP
U9 = LM1117MPX-3.3/NOPB: BOM_Manufacturer: TI; BOM_Manufacturer Part: LM1117IMPX-3.3/NOPB; SMT Type: Extend; BOM_Assembly Type: smtWeld; BOM_Paste Type: expand; BOM_Supplier: LCSC; image: //image.lceda.cn/szlcsc/C9662.jpg; BOM_Supplier Part: C23984; BOM_JLCPCB SMD: Yes; BOM_LCSC Assembly: Yes; spicePre: U; spiceSymbolName: LM1117MPX-3.3/NOPB
U10 = LM358DR2G: BOM_Manufacturer: ON; SMT Type: Basic; spicePre: X; BOM_Supplier: LCSC; BOM_Manufacturer Part: LM358DR2G; image: //image.lceda.cn/szlcsc/C7950.jpg; BOM_Supplier Part: C7950; BOM_JLCPCB SMD: Yes; BOM_LCSC Assembly: Yes; spiceSymbolName: LM358DR2G
U11-U16 U18 U19 = PC817X3NIP1B: BOM_Manufacturer: EVERLIGHT; BOM_Manufacturer Part: EL357N(C)(TA)-G; Contributor: LCSC; SMT Type: Extend; BOM_Supplier: LCSC; BOM_Supplier Part: C29981; BOM_JLCPCB SMD: Yes; spicePre: U; spiceSymbolName: PC817X3NIP1B
U17 = IF1205S-2W: BOM_Manufacturer: Bothhand Enterprise; Contributor: LCSC; BOM_Supplier: LCSC; BOM_Supplier Part: C494963; BOM_Manufacturer Part: IF1205S-2W; spicePre: U; spiceSymbolName: IF1205S-2W
U20 = TLP104(TPL,E: BOM_Manufacturer: TOSHIBA; Contributor: LCSC; SMT Type: Extend; BOM_Supplier: LCSC; BOM_Manufacturer Part: TLP104(TPL,E; BOM_Supplier Part: C48236; BOM_JLCPCB SMD: Yes; BOM_LCSC Assembly: Yes; spicePre: U; spiceSymbolName: TLP104(TPL,E